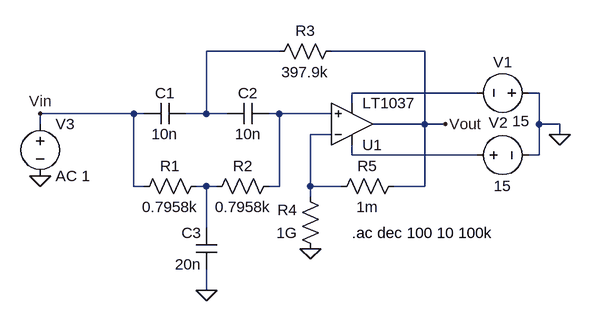
[diagram p0: schematic scheme5.asc]
scheme5.asc, the LTspice schematic file:
Version 4.1
SHEET 1 880 680
WIRE 80 48 -32 48
WIRE 304 48 160 48
WIRE 384 112 192 112
WIRE 480 112 464 112
WIRE 192 128 192 112
WIRE -144 144 -288 144
WIRE -128 144 -144 144
WIRE -32 144 -32 48
WIRE -32 144 -64 144
WIRE 0 144 -32 144
WIRE 80 144 64 144
WIRE 160 144 80 144
WIRE -288 160 -288 144
WIRE 304 160 304 48
WIRE 304 160 224 160
WIRE 336 160 304 160
WIRE 480 160 480 112
WIRE 512 160 480 160
WIRE 160 176 128 176
WIRE 512 176 512 160
WIRE 192 208 192 192
WIRE 384 208 192 208
WIRE 480 208 480 160
WIRE 480 208 464 208
WIRE -144 256 -144 144
WIRE -128 256 -144 256
WIRE -32 256 -48 256
WIRE -16 256 -32 256
WIRE 80 256 80 144
WIRE 80 256 64 256
WIRE 128 256 128 176
WIRE 176 256 128 256
WIRE 304 256 304 160
WIRE 304 256 256 256
WIRE 128 272 128 256
WIRE -32 320 -32 256
WIRE -32 416 -32 384
FLAG -32 416 0
FLAG 128 352 0
FLAG 512 176 0
FLAG -288 240 0
FLAG -288 144 Vin
FLAG 336 160 Vout
SYMBOL OpAmps\\LT1037 192 224 M180
SYMATTR InstName U1
SYMBOL res -32 240 R90
WINDOW 0 0 56 VBottom 2
WINDOW 3 32 56 VTop 2
SYMATTR InstName R1
SYMATTR Value 0.7958k
SYMBOL res 80 240 R90
WINDOW 0 0 56 VBottom 2
WINDOW 3 32 56 VTop 2
SYMATTR InstName R2
SYMATTR Value 0.7958k
SYMBOL res 176 32 R90
WINDOW 0 0 56 VBottom 2
WINDOW 3 32 56 VTop 2
SYMATTR InstName R3
SYMATTR Value 397.9k
SYMBOL res 144 368 R180
WINDOW 0 36 76 Left 2
WINDOW 3 36 40 Left 2
SYMATTR InstName R4
SYMATTR Value 1G
SYMBOL res 160 272 R270
WINDOW 0 32 56 VTop 2
WINDOW 3 0 56 VBottom 2
SYMATTR InstName R5
SYMATTR Value 1m
SYMBOL cap -64 128 R90
WINDOW 0 0 32 VBottom 2
WINDOW 3 32 32 VTop 2
SYMATTR InstName C1
SYMATTR Value 10n
SYMBOL cap 64 128 R90
WINDOW 0 0 32 VBottom 2
WINDOW 3 32 32 VTop 2
SYMATTR InstName C2
SYMATTR Value 10n
SYMBOL cap -16 384 R180
WINDOW 0 24 56 Left 2
WINDOW 3 24 8 Left 2
SYMATTR InstName C3
SYMATTR Value 20n
SYMBOL voltage 480 112 R90
WINDOW 0 -32 56 VBottom 2
WINDOW 3 28 28 VTop 2
SYMATTR InstName V1
SYMATTR Value 15
SYMBOL voltage 368 208 R270
WINDOW 0 35 49 VTop 2
WINDOW 3 -32 56 VBottom 2
SYMATTR InstName V2
SYMATTR Value 15
SYMBOL voltage -288 144 R0
SYMATTR InstName V3
SYMATTR Value AC 1
TEXT 192 328 Left 2 !.ac dec 100 10 100k

The netlist it stands for:
* scheme5.asc
X§U1 N003 N004 N005 N002 Vout LT1037  ; pins In+ In- V+ V- OUT
R1 N006 Vin 0.7958k
R2 N003 N006 0.7958k
R3 Vout N001 397.9k
R4 0 N004 1G
R5 N004 Vout 1m
C1 N001 Vin 10n
C2 N003 N001 10n
C3 0 N006 20n
V1 0 N002 15
V2 N005 0 15
V3 Vin 0 AC 1
.ac dec 100 10 100k
.backanno
.end